# Altium schematic sheet MCU.SchDoc: MCU
size A; Author: James Mackaman; SheetNumber: 1; SheetTotal: 7
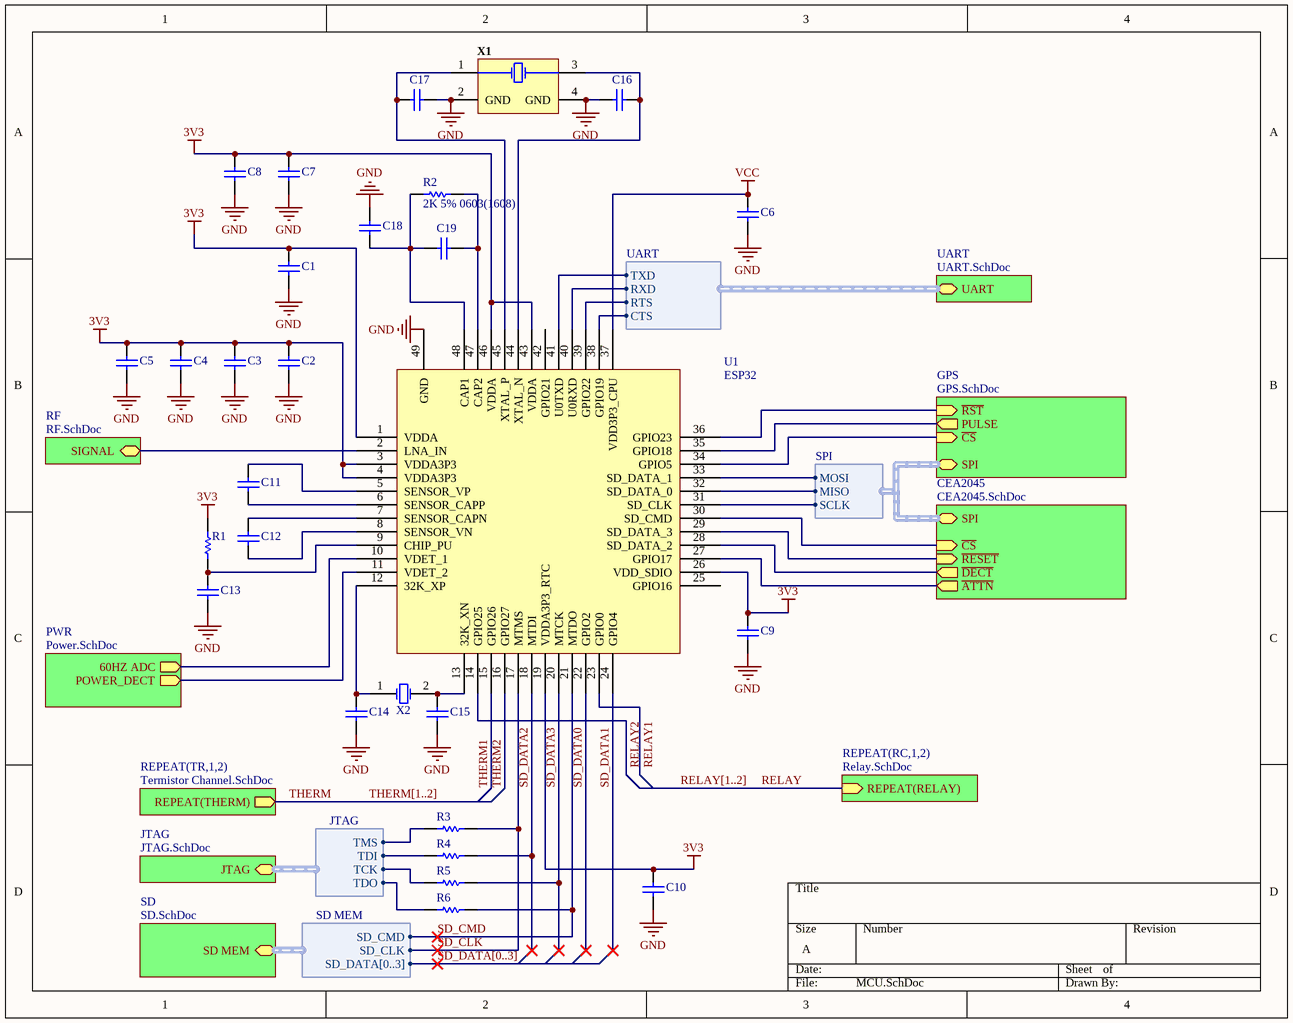
[diagram p0: MCU.SchDoc]

## Parts
C1  CAP 100nF 6.3V 0603(1608)  [CAPC0603(1608)100_M]  (value not drawn)
C2  CAP 100nF 6.3V 0603(1608)  [CAPC0603(1608)100_M]  (value not drawn)
C3  CAP 10uF 6.3V 1210(3225)  [CAPC1210(3225)170_L]  (value not drawn)
C4  CAP 10uF 6.3V 1210(3225)  [CAPC1210(3225)170_L]  (value not drawn)
C5  CAP 1uF 6.3V 0603(1608)  [CAPC0603(1608)100_N]  (value not drawn)
C6  CAP 100nF 6.3V 0603(1608)  [CAPC0603(1608)100_M]  (value not drawn)
C7  CAP 1uF 6.3V 0603(1608)  [CAPC0603(1608)100_N]  (value not drawn)
C8  CAP 100pF 10V 0603(1608)  [CAPC0603(1608)100_N]  (value not drawn)
C9  CAP 1uF 6.3V 0603(1608)  [CAPC0603(1608)100_N]  (value not drawn)
C10  CAP 100nF 6.3V 0603(1608)  [CAPC0603(1608)100_M]  (value not drawn)
C11  CAP 220pF 6.3V 0603(1608)  [CAPC0603(1608)100_N]  (value not drawn)
C12  CAP 100nF 6.3V 0603(1608)  [CAPC0603(1608)100_M]  (value not drawn)
C13  CAP 100nF 6.3V 0603(1608)  [CAPC0603(1608)100_M]  (value not drawn)
C14  CAP 12pF 16V 0603(1608)  [CAPC0603(1608)100_M]  (value not drawn)
C15  CAP 12pF 16V 0603(1608)  [CAPC0603(1608)100_M]  (value not drawn)
C16  CAP 22pF 16V 0603(1608)  [CAPC0603(1608)100_M]  (value not drawn)
C17  CAP 10pF 10V 0603(1608)  [CAPC0603(1608)100_M]  (value not drawn)
C18  CAP 10nF 6.3V 0603(1608)  [CAPC0603(1608)100_M]  (value not drawn)
C19  CAP 3.3nF 6.3V 0603(1608)  [CAPC0603(1608)100_L]  (value not drawn)
R1  1K 5% 0603(1608)  [RESC0603(1608)_L]  (value not drawn)
R2  2K 5% 0603(1608)  [RESC0603(1608)_N]
R3  100R 5% 0603(1608)  [RESC0603(1608)_L]  (value not drawn)
R4  100R 5% 0603(1608)  [RESC0603(1608)_L]  (value not drawn)
R5  100R 5% 0603(1608)  [RESC0603(1608)_L]  (value not drawn)
R6  100R 5% 0603(1608)  [RESC0603(1608)_L]  (value not drawn)
U1  ESP32  [QFN40P600X600X90_HS-49N]
X1  7B-40.000MAAJ-T  [TXC-7B-4_V]  (value not drawn)
X2  14340272-32.768KHz  [ITTI-14340272-32.768KHz-2_V]  (value not drawn)

## Sub-sheets
CEA2045 = CEA2045.SchDoc: ~{ATTN} (out), SPI (harness SPI), ~{RESET} (in), ~{DECT} (out), ~{CS} (in)
GPS = GPS.SchDoc: SPI (harness SPI), ~{CS} (in), PULSE (out), ~{RST} (in)
JTAG = JTAG.SchDoc: JTAG (harness JTAG)
PWR = Power.SchDoc: 60HZ ADC (out), POWER_DECT (out)
REPEAT(RC,1,2) = Relay.SchDoc: REPEAT(RELAY) (in)
REPEAT(TR,1,2) = Termistor Channel.SchDoc: REPEAT(THERM) (out)
RF = RF.SchDoc: SIGNAL (bidir)
SD = SD.SchDoc: SD MEM (harness SD MEM)
UART = UART.SchDoc: UART (harness UART)

## Harnesses
JTAG: TDI, TDO, TCK, TMS
UART: TXD, RXD, RTS, CTS
SPI: MISO, SCLK, MOSI
SD MEM: SD_DATA[0..3], SD_CLK, SD_CMD

## Nets
3V3: C1.2 C2.2 C3.2 C4.2 C5.1 C7.1 C8.2 C9.1 C10.2 R1.2 U1.1(VDDA) U1.3(VDDA3P3) U1.4(VDDA3P3) U1.19(VDDA3P3_RTC) U1.26(VDD_SDIO) U1.43(VDDA) U1.46(VDDA)
GND: C1.1 C2.1 C3.1 C4.1 C5.2 C6.1 C7.2 C8.1 C9.2 C10.1 C13.1 C14.1 C15.1 C16.1 C17.1 C18.2 U1.49(GND) X1.2(GND) X1.4(GND)
VCC: C6.2 U1.37(VDD3P3_CPU)
RELAY: sheet REPEAT(RC,1,2)/REPEAT(RELAY)
RELAY1: U1.23(GPIO0)
RELAY2: U1.14(GPIO25)
SD_CLK: R3.2 U1.17(MTMS) ; sheet SD/SD MEM.SD_CLK
SD_CMD: R6.2 U1.21(MTDO) ; sheet SD/SD MEM.SD_CMD
SD_DATA0: U1.22(GPIO2)
SD_DATA1: U1.24(GPIO4)
SD_DATA2: R4.2 U1.18(MTDI)
SD_DATA3: R5.2 U1.20(MTCK)
THERM: sheet REPEAT(TR,1,2)/REPEAT(THERM)
THERM1: U1.15(GPIO26)
THERM2: U1.16(GPIO27)
NetC11_1: C11.1 U1.6(SENSOR_CAPP)
NetC11_2: C11.2 U1.5(SENSOR_VP)
NetC12_1: C12.1 U1.8(SENSOR_VN)
NetC12_2: C12.2 U1.7(SENSOR_CAPN)
NetC13_2: C13.2 R1.1 U1.9(CHIP_PU)
NetC14_2: C14.2 U1.12(32K_XP) X2.1(X1)
NetC15_2: C15.2 U1.13(32K_XN) X2.2(X2)
NetC16_2: C16.2 U1.44(XTAL_N) X1.3(X2)
NetC17_2: C17.2 U1.45(XTAL_P) X1.1(X1)
NetC18_1: C18.1 C19.1 R2.1 U1.48(CAP1)
NetC19_2: C19.2 R2.2 U1.47(CAP2)
NetR3_1: R3.1 ; sheet JTAG/JTAG.TMS
NetR4_1: R4.1 ; sheet JTAG/JTAG.TDI
NetR5_1: R5.1 ; sheet JTAG/JTAG.TCK
NetR6_1: R6.1 ; sheet JTAG/JTAG.TDO
NetU1_2: U1.2(LNA_IN) ; sheet RF/SIGNAL
NetU1_10: U1.10(VDET_1) ; sheet PWR/60HZ ADC
NetU1_11: U1.11(VDET_2) ; sheet PWR/POWER_DECT
NetU1_27: U1.27(GPIO17) ; sheet CEA2045/~{ATTN}
NetU1_28: U1.28(SD_DATA_2) ; sheet CEA2045/~{DECT}
NetU1_29: U1.29(SD_DATA_3) ; sheet CEA2045/~{RESET}
NetU1_30: U1.30(SD_CMD) ; sheet CEA2045/~{CS}
NetU1_31: U1.31(SD_CLK) ; sheet CEA2045/SPI.SCLK
NetU1_32: U1.32(SD_DATA_0) ; sheet CEA2045/SPI.MISO
NetU1_33: U1.33(SD_DATA_1) ; sheet CEA2045/SPI.MOSI
NetU1_34: U1.34(GPIO5) ; sheet GPS/~{CS}
NetU1_35: U1.35(GPIO18) ; sheet GPS/PULSE
NetU1_36: U1.36(GPIO23) ; sheet GPS/~{RST}
NetU1_38: U1.38(GPIO19) ; sheet UART/UART.CTS
NetU1_39: U1.39(GPIO22) ; sheet UART/UART.RTS
NetU1_40: U1.40(U0RXD) ; sheet UART/UART.RXD
NetU1_41: U1.41(U0TXD) ; sheet UART/UART.TXD

Not connected (* = marked no-connect by the designer): U1 25(GPIO16) 42(GPIO21)

## Buses and harness runs
bus RELAY[1..2]
bus SD_DATA[0..3]
bus THERM[1..2]
harness sheet CEA2045/SPI = sheet GPS/SPI

## Library data of the parts
C1 C2 C6 C10 C12 C13 = CMP-1035-02575-1: CAP 100nF 6.3V ±5% 0603 (1608 Metric) Thickness 1mm SMD; Case-EIA: 0603; Tolerance: Â±5%; Case-Metric: 1608; Technology: SMT; Value: 100nF; Rated Voltage: 6.3 V; Max Thickness: 1 mm
C3 C4 = CMP-1038-02188-1: CAP 10uF 6.3V ±10% 1210 (3225 Metric) Thickness 1.7mm SMD; Case-EIA: 1210; Tolerance: Â±10%; Case-Metric: 3225; Rated Voltage: 6.3 V; Technology: SMT; Max Thickness: 1.7 mm; Value: 10uF
C5 C7 C9 = CMP-1035-02730-1: CAP 1uF 6.3V ±10% 0603 (1608 Metric) Thickness 1mm SMD; Case-Metric: 1608; Tolerance: Â±10%; Case-EIA: 0603; Max Thickness: 1 mm; Technology: SMT; Rated Voltage: 6.3 V; Value: 1uF
C8 = CMP-1035-01255-1: CAP 100pF 10V ±10% 0603 (1608 Metric) Thickness 1mm SMD; Case-Metric: 1608; Tolerance: Â±10%; Case-EIA: 0603; Max Thickness: 1 mm; Value: 100pF; Rated Voltage: 10 V; Technology: SMT
C11 = CMP-1035-01452-1: CAP 220pF 6.3V ±10% 0603 (1608 Metric) Thickness 1mm SMD; Tolerance: Â±10%; Case-Metric: 1608; Case-EIA: 0603; Max Thickness: 1 mm; Rated Voltage: 6.3 V; Value: 220pF; Technology: SMT
C14 C15 = CMP-1035-00607-1: CAP 12pF 16V ±10% 0603 (1608 Metric) Thickness 1mm SMD; Case-Metric: 1608; Tolerance: Â±10%; Case-EIA: 0603; Value: 12pF; Max Thickness: 1 mm; Technology: SMT; Rated Voltage: 16 V
C16 = CMP-1035-00809-1: CAP 22pF 16V ±10% 0603 (1608 Metric) Thickness 1mm SMD; Tolerance: Â±10%; Case-Metric: 1608; Case-EIA: 0603; Technology: SMT; Rated Voltage: 16 V; Value: 22pF; Max Thickness: 1 mm
C17 = CMP-1035-00539-1: CAP 10pF 10V ±10% 0603 (1608 Metric) Thickness 1mm SMD; Tolerance: Â±10%; Case-EIA: 0603; Case-Metric: 1608; Max Thickness: 1 mm; Technology: SMT; Rated Voltage: 10 V; Value: 10pF
C18 = CMP-1035-02302-1: CAP 10nF 6.3V ±10% 0603 (1608 Metric) Thickness 1mm SMD; Case-Metric: 1608; Tolerance: Â±10%; Case-EIA: 0603; Max Thickness: 1 mm; Value: 10nF; Rated Voltage: 6.3 V; Technology: SMT
C19 = CMP-1035-02104-1: CAP 3.3nF 6.3V ±10% 0603 (1608 Metric) Thickness 1mm SMD; Case-EIA: 0603; Case-Metric: 1608; Tolerance: Â±10%; Rated Voltage: 6.3 V; Technology: SMT; Max Thickness: 1 mm; Value: 3.3nF
R1 = CMP-1012-00074-1: 1K 0.1W 5% 0603 (1608 Metric)  SMD; Case-Metric: 1608; Case-EIA: 0603; Value: 1000.00 Ohm; Power: 0.1 W; Technology: SMT; Tolerance: 5 %
R2 = CMP-1012-00081-1: 2K 0.1W 5% 0603 (1608 Metric)  SMD; Case-EIA: 0603; Value: 2000.00 Ohm; Case-Metric: 1608; Tolerance: 5 %; Power: 0.1 W; Technology: SMT
R3-R6 = CMP-1012-00050-1: 100R 0.1W 5% 0603 (1608 Metric)  SMD; Value: 100.00 Ohm; Case-EIA: 0603; Case-Metric: 1608; Technology: SMT; Power: 0.1 W; Tolerance: 5 %
X1 = CMP-1774-00003-1: 9B Series Quartz Crystal, 40 MHz, +/-30 ppm, 18 pF, -40 to 85 degC, 4-Pin SMD, RoHS, Tape and Reel; Tolerance: 1%; Voltage Rating: 75 V; Resistance: 8.2 kohm; Power Rating: 100 mW; Case\Package: 0603; Height: 0.45 mm; Case Code (Metric): 1608; Packaging: Tape and Reel; PackageReference: 7B-4; Length: 1.6 mm; RoHSCompliant: true; DatasheetVersion: Jan-10; ComponentLink1URL: http://www.txccrystal.com/images/pdf/7b.pdf; Radiation Hardening: No; PackageDescription: 4-Pin Surface Mount Device, Body 5 x 3.2 mm, Pitch 3.7 mm; Mount: Surface Mount; ComponentLink1Description: Datasheet; Min Operating Temperature: -55 degC; Max Operating Temperature: 155 degC; Width: 0.8 mm; Case Code (Imperial): 0603; Package Quantity: 5000; REACH SVHC: Yes; Pins: 2
X2 = CMP-0463-00001-2: Crystal, 32.768 KHz, -40 to 85 degC, 3.2 x 1.5 x 0.9 mm SMD; Manufacturer: ITTI; Load Capacitance: 12.5 pF; Frequency Tolerance: +/-20 ppm; Drive Level: 1 max. uw; Nominal Frequency: 32.768KHz; Mounting Technology: Surface Mount; Operating temperature: -40 to 85 degC; PartNumber: 14340272-32.768KHz; ComponentLink1URL: http://www.itti-co.com; ComponentLink1Description: Manufacturer URL; PackageReference: 14340272-32.768KHz-2; PackageDescription: 2-Pin Hand Drawn, Body 3.2 x 1.5mm, Pitch 2.5 mm